# Altium project PCB_Project_2.PrjPcb
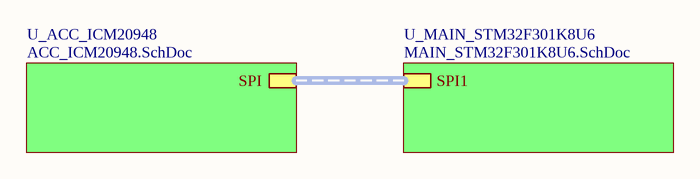
[diagram p0: mHealth.SchDoc]
3 sheets, 16 parts. Net scope: hierarchical (ports join the sheet entries above them; power ports are global).
Board file: CORE_Prototype_1.PcbDoc
Sheets:
  mHealth.SchDoc
    U_ACC_ICM20948 = ACC_ICM20948.SchDoc
    U_MAIN_STM32F301K8U6 = MAIN_STM32F301K8U6.SchDoc

## Sheet mHealth.SchDoc
size Letter; SheetNumber: 1

### Sub-sheets
U_ACC_ICM20948 = ACC_ICM20948.SchDoc: SPI (harness SPI)
U_MAIN_STM32F301K8U6 = MAIN_STM32F301K8U6.SchDoc: SPI1 (harness SPI)

### Buses and harness runs
harness sheet U_ACC_ICM20948/SPI = sheet U_MAIN_STM32F301K8U6/SPI1

## Sheet ACC_ICM20948.SchDoc
size A; SheetNumber: 2
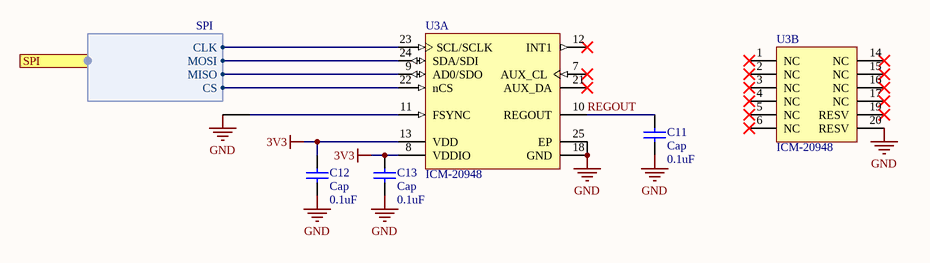
[diagram p1: ACC_ICM20948.SchDoc]

### Parts
C11  Cap  value 0.1uF  [CAPC1005N]
C12  Cap  value 0.1uF  [CAPC1005N]
C13  Cap  value 0.1uF  [CAPC1005N]
U3  ICM-20948  [TDK-QFN-24_M]  (parts A,B of 2)

### Ports
SPI (harness SPI)

### Harnesses
SPI: MOSI, MISO, CS, CLK

### Nets
3V3: C12.2 C13.2 U3.8(VDDIO) U3.13(VDD)
GND: C11.1 C12.1 C13.1 U3.11(FSYNC) U3.18(GND) U3.20(RESV) U3.25(EP)
REGOUT: C11.2 U3.10(REGOUT)  [project net REGOUT_2]
SPI_CLK: U3.23(SCL/SCLK) ; port SPI.CLK
SPI_CS1: U3.22(nCS) ; port SPI.CS
SPI_MISO: U3.9(AD0/SDO) ; port SPI.MISO
SPI_MOSI: U3.24(SDA/SDI) ; port SPI.MOSI

Not connected (* = marked no-connect by the designer): U3 1(NC)* 2(NC)* 3(NC)* 4(NC)* 5(NC)* 6(NC)* 7(AUX_CL)* 12(INT1)* 14(NC)* 15(NC)* 16(NC)* 17(NC)* 19(RESV)* 21(AUX_DA)*

### Library data of the parts
C11-C13 = Cap: Capacitor; Published: 8-Jun-2000; LatestRevisionDate: 17-Jul-2002; LatestRevisionNote: Re-released for DXP Platform.; PackageReference: RAD-0.3; Publisher: Altium Limited; PackageDescription: Radial Cap, Thru-Hole; 2 Leads; 0.3 in Pin Spacing
U3 = CMP-2000-07532-1: World’s Lowest Power 9-Axis MEMS MotionTracking(TM) Device, 1.71 to 3.6 V, -40 to 85 degC, 24-Pin QFN, RoHS, Tape and Reel; Manufacturer: TDK; Package Description: 24-Pin Quad Flat No-lead Package, Body 3 x 3 mm, Pitch 0.4 mm; Datasheet Version: Rev. 1.3, 06/2017; Package Reference: QFN-24; Mounting Technology: SurfaceMount; Datasheet URL: https://www.invensense.com/wp-content/uploads/2016/06/DS-000189-ICM-20948-v1.3.pdf; Manufacturer URL: http://www.tdk.com/

## Sheet MAIN_STM32F301K8U6.SchDoc
size B; SheetNumber: 4
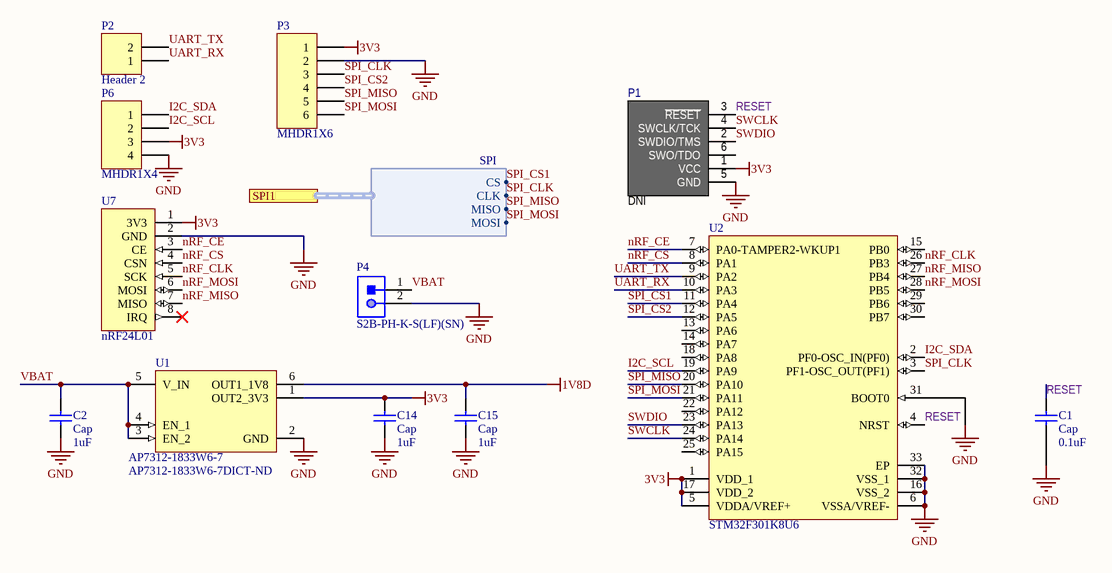
[diagram p2: MAIN_STM32F301K8U6.SchDoc]

### Parts
C1  Cap  value 0.1uF  [CAPC1005N]
C2  Cap  value 1uF  [CAPC1005N]
C14  Cap  value 1uF  [CAPC1005N]
C15  Cap  value 1uF  [CAPC1005N]
P1  DNI  [TC2030-NL]  (no BOM)
P2  Header 2  [MHDR1X2]
P3  MHDR1X6  [MHDR1X6]
P4  S2B-PH-K-S(LF)(SN)  [JST-S2B-PH-K-S_V]
P6  MHDR1X4  [MHDR1X4]
U1  AP7312-1833W6-7  Supplier Part Number 1: AP7312-1833W6-7DICT-ND  [SOT95P285X145-6N]
U2  STM32F301K8U6  [STM-UFQFPN32_L]
U7  nRF24L01  [MHDR1X8]

### Ports
SPI1 (harness SPI)

### Harnesses
SPI: MOSI, MISO, CS, CLK

### Nets
1V8D: C15.2 U1.6(OUT1_1V8)
3V3: C14.2 P1.1(VCC) P3.1 P6.3 U1.1(OUT2_3V3) U2.1(VDD_1) U2.5(VDDA/VREF+) U2.17(VDD_2) U7.1(3V3)
GND: C1.1 C2.1 C14.1 C15.1 P1.5(GND) P3.2 P4.2 P6.4 U1.2(GND) U2.6(VSSA/VREF-) U2.16(VSS_2) U2.31(BOOT0) U2.32(VSS_1) U2.33(EP) U7.2(GND)
I2C_SCL: P6.2 U2.19(PA9)  [project net I2C_SCL_4]
I2C_SDA: P6.1 U2.2(PF0-OSC_IN(PF0))  [project net I2C_SDA_4]
nRF_CE: U2.7(PA0-TAMPER2-WKUP1) U7.3(CE)  [project net nRF_CE_4]
nRF_CLK: U2.26(PB3) U7.5(SCK)  [project net nRF_CLK_4]
nRF_CS: U2.8(PA1) U7.4(CSN)  [project net nRF_CS_4]
nRF_MISO: U2.27(PB4) U7.7(MISO)  [project net nRF_MISO_4]
nRF_MOSI: U2.28(PB5) U7.6(MOSI)  [project net nRF_MOSI_4]
RESET: C1.2 P1.3(~{RESET}) U2.4(NRST)  [project net RESET_4]
SPI_CLK: P3.3 U2.3(PF1-OSC_OUT(PF1)) ; port SPI1.CLK
SPI_CS1: U2.11(PA4) ; port SPI1.CS
SPI_CS2: P3.4 U2.12(PA5)  [project net SPI_CS2_4]
SPI_MISO: P3.5 U2.20(PA10) ; port SPI1.MISO
SPI_MOSI: P3.6 U2.21(PA11) ; port SPI1.MOSI
SWCLK: P1.4(SWCLK/TCK) U2.24(PA14)  [project net SWCLK_4]
SWDIO: P1.2(SWDIO/TMS) U2.23(PA13)  [project net SWDIO_4]
UART_RX: P2.1 U2.10(PA3)  [project net UART_RX_4]
UART_TX: P2.2 U2.9(PA2)  [project net UART_TX_4]
VBAT: C2.2 P4.1 U1.3(EN_2) U1.4(EN_1) U1.5(V_IN)  [project net VBAT_4]

Not connected (* = marked no-connect by the designer): P1 6(SWO/TDO); U2 13(PA6) 14(PA7) 15(PB0) 18(PA8) 22(PA12) 25(PA15) 29(PB6) 30(PB7); U7 8(IRQ)*

### Library data of the parts
C1 C2 C14 C15 = Cap: Capacitor; Published: 8-Jun-2000; LatestRevisionDate: 17-Jul-2002; LatestRevisionNote: Re-released for DXP Platform.; PackageReference: RAD-0.3; Publisher: Altium Limited; PackageDescription: Radial Cap, Thru-Hole; 2 Leads; 0.3 in Pin Spacing
P1 = TC2030-CTX
P2 = Header 2: Header, 2-Pin; LatestRevisionDate: 17-Jul-2002; LatestRevisionNote: Re-released for DXP Platform.; Publisher: Altium Limited
P3 = MHDR1X6: Header, 6-Pin; LatestRevisionDate: 17-Jul-2002; LatestRevisionNote: Re-released for DXP Platform.; Publisher: Altium Limited
P4 = CMP-1755-00004-1: Male Header, Pitch 2 mm, 1 x 2 Position, Height 4.8 mm, Tail Length 3.4 mm, -25 to 85 degC, RoHS, Bulk; Case\Package: Radial; Tolerance: 20%; Capacitance: 10 uF; Voltage Rating (DC): 50 V; Packaging: Bulk; ComponentLink1URL: http://www.jst-mfg.com/product/pdf/eng/ePH.pdf; Radiation Hardening: No; Height: 11 mm; Package Quantity: 200; PackageDescription: Male Header, Pitch 2 mm, 1 x 2 Position, Height 4.8 mm, Tail Length 3.4 mm; PackageReference: S2B-PH-K-S; Diameter: 5 mm; Pins: 2; Mount: Through Hole; Max Operating Temperature: 85 degC; Min Operating Temperature: -40 degC; ComponentLink1Description: Datasheet; DatasheetVersion: Dec-12; Length: 11 mm; Lead Pitch: 2 mm; REACH SVHC: No SVHC; Voltage Rating: 50 V; RoHSCompliant: true
P6 = MHDR1X4: Header, 4-Pin; LatestRevisionDate: 17-Jul-2002; LatestRevisionNote: Re-released for DXP Platform.; Publisher: Altium Limited
U1 = AP7312-1833W6-7: IC REG LINEAR 1.8V/3.3V SOT26; Manufacturer 1: Diodes; Number of Outputs: 2; Min Input Voltage: 2V; Max Input Voltage: 6V; Max Output Current: 150mA; Max Power Dissipation: 950mW; Polarity: Positive; Quiescent Current: 80uA; Accuracy: 2%; Output Type: Fixed; Dropout Voltage: 150mV; Output Voltage: 3.3V; Min Current Limit: 200mA; Operating Supply Current: 60uA; Voltage - Output 1: 1.8V; Reference Voltage: 800mV; Power Supply Rejection Ratio (PSRR): 65dB; Supplier 1: Digi-Key; Manufacturer Part Number 1: AP7312-1833W6-7; Stock 1: 17585; Pricing 1: 1=0.59000, 10=0.52100, 100=0.37100, 500=0.29994, 1000=0.22890 (USD); RoHS: Yes; Mount: Surface Mount; Case/Package: SOT-26; Number of Pins: 6; Contact Plating: Tin,Matte; Min Operating Temperature: -40°C; Max Operating Temperature: 85°C; Output Current: 150mA; Package Quantity: 3000; Packaging: Tape and Reel; Power Rating: 950mW; Number of Regulators: 2; Current - Output 1: 150mA; Current - Output 2: 150mA; Voltage - Output 2: 3.3V; Power Dissipation: 950mW; Output Voltage Accuracy: 2%; Length: 3.1mm; Height: 1.3mm; Width: 1.7mm; Radiation Hardening: No; REACH SVHC: No SVHC; Lead Free: Lead Free; ComponentLink1URL: https://datasheet.ciiva.com/30477/0900766b8115c2c0-30477178.pdf?src-supplier=RSComponents; ComponentLink1Description: https://datasheet.ciiva.com/30477/0900766b8115c2c0-30477178.pdf?src-supplier=RSComponents; ComponentLink2URL: https://datasheet.ciiva.com/8078/1636610-8078247.pdf?src-supplier=Element14; ComponentLink2Description: https://datasheet.ciiva.com/8078/1636610-8078247.pdf?src-supplier=Element14; ComponentLink3URL: https://datasheet.ciiva.com/8239/ap7312-8239997.pdf?src-supplier=Avnet; ComponentLink3Description: https://datasheet.ciiva.com/8239/ap7312-8239997.pdf?src-supplier=Avnet
U2 = CMP-0537-00006-1: ARM Cortex-M4 32-bit MCU, 64 KB Flash, 16 KB Internal RAM, 24 I/Os, 32-Pin UFQFPN, -40 to 85 degC, Tray; Operating Frequency(F) (Processor speed) (MHz): 72; Internal RAM Size (kB): 16; D/A Converter: 1; FLASH Size (Prog) (kB): 64; I/Os (High Current): 24; Supply Voltage(Vcc) min (V): 2; DatasheetVersion: Rev. 6; Core: ARM Cortex-M4; ComponentLink2Description: Datasheet; Packing: Tray; ComponentLink2URL: http://www.st.com/st-web-ui/static/active/en/resource/technical/document/datasheet/DM00093332.pdf; Package Reference: UFQFPN32; ComponentLink1Description: Manufacturer URL; Mounting Technology: Surface Mount; ComponentLink1URL: http://www.st.com/; Package Description: 32-Pin Ultra Thin Fine Pitch Quad Flat No-Lead, 5 x 5 x 0.6 mm Body, 0.5 mm Pitch, Exposed Pad 3.5 x 3.5 mm

## Nets that join several sheets
3V3: ACC_ICM20948 (C12.2 C13.2 U3.8 U3.13), MAIN_STM32F301K8U6 (9 pins)
GND: ACC_ICM20948 (7 pins), MAIN_STM32F301K8U6 (15 pins)
SPI_CLK: ACC_ICM20948 (U3.23), MAIN_STM32F301K8U6 (P3.3 U2.3)
SPI_CS1: ACC_ICM20948 (U3.22), MAIN_STM32F301K8U6 (U2.11)
SPI_MISO: ACC_ICM20948 (U3.9), MAIN_STM32F301K8U6 (P3.5 U2.20)
SPI_MOSI: ACC_ICM20948 (U3.24), MAIN_STM32F301K8U6 (P3.6 U2.21)